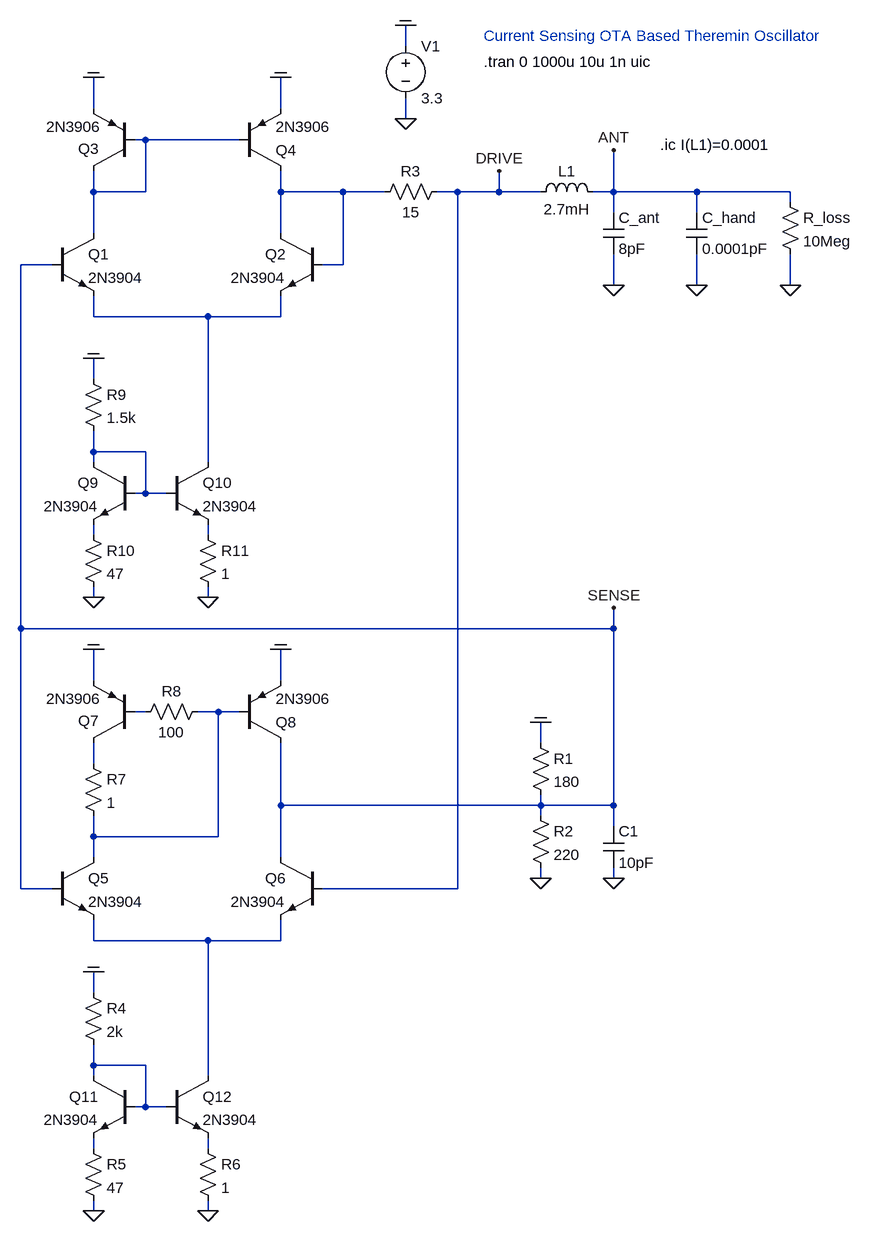
[diagram p0: schematic 2023_03_bjt_dual_ota_current_sensing_oscillator_v01.asc]
2023_03_bjt_dual_ota_current_sensing_oscillator_v01.asc, the LTspice schematic file:
Version 4
SHEET 1 16292 18036
WIRE 8192 11392 8192 11360
WIRE 7712 11488 7712 11440
WIRE 8000 11488 8000 11440
WIRE 8192 11504 8192 11472
WIRE 7792 11536 7776 11536
WIRE 7936 11536 7792 11536
WIRE 7712 11616 7712 11584
WIRE 7792 11616 7792 11536
WIRE 7792 11616 7712 11616
WIRE 8000 11616 8000 11584
WIRE 8096 11616 8000 11616
WIRE 8160 11616 8096 11616
WIRE 8272 11616 8240 11616
WIRE 8336 11616 8336 11584
WIRE 8336 11616 8272 11616
WIRE 8400 11616 8336 11616
WIRE 8512 11616 8512 11552
WIRE 8512 11616 8480 11616
WIRE 8640 11616 8512 11616
WIRE 8784 11616 8640 11616
WIRE 8784 11632 8784 11616
WIRE 8512 11648 8512 11616
WIRE 8640 11648 8640 11616
WIRE 7712 11680 7712 11616
WIRE 8000 11680 8000 11616
WIRE 7648 11728 7600 11728
WIRE 8096 11728 8096 11616
WIRE 8096 11728 8064 11728
WIRE 8512 11760 8512 11712
WIRE 8640 11760 8640 11712
WIRE 8784 11760 8784 11712
WIRE 7712 11808 7712 11776
WIRE 7888 11808 7712 11808
WIRE 8000 11808 8000 11776
WIRE 8000 11808 7888 11808
WIRE 7712 11904 7712 11872
WIRE 7712 12016 7712 11984
WIRE 7792 12016 7712 12016
WIRE 7712 12032 7712 12016
WIRE 7888 12032 7888 11808
WIRE 7792 12080 7792 12016
WIRE 7792 12080 7776 12080
WIRE 7824 12080 7792 12080
WIRE 7712 12144 7712 12128
WIRE 7888 12144 7888 12128
WIRE 7712 12240 7712 12224
WIRE 7888 12240 7888 12224
WIRE 7600 12288 7600 11728
WIRE 8512 12288 8512 12256
WIRE 8512 12288 7600 12288
WIRE 7712 12368 7712 12320
WIRE 8000 12368 8000 12320
WIRE 7792 12416 7776 12416
WIRE 7904 12416 7872 12416
WIRE 7936 12416 7904 12416
WIRE 8400 12464 8400 12432
WIRE 7712 12496 7712 12464
WIRE 8000 12560 8000 12464
WIRE 8400 12560 8400 12544
WIRE 8400 12560 8000 12560
WIRE 8512 12560 8512 12288
WIRE 8512 12560 8400 12560
WIRE 8400 12576 8400 12560
WIRE 8512 12592 8512 12560
WIRE 7712 12608 7712 12576
WIRE 7904 12608 7904 12416
WIRE 7904 12608 7712 12608
WIRE 7712 12640 7712 12608
WIRE 8000 12640 8000 12560
WIRE 8400 12672 8400 12656
WIRE 8512 12672 8512 12656
WIRE 7600 12688 7600 12288
WIRE 7648 12688 7600 12688
WIRE 8272 12688 8272 11616
WIRE 8272 12688 8064 12688
WIRE 7712 12768 7712 12736
WIRE 7888 12768 7712 12768
WIRE 8000 12768 8000 12736
WIRE 8000 12768 7888 12768
WIRE 7712 12848 7712 12816
WIRE 7712 12960 7712 12928
WIRE 7792 12960 7712 12960
WIRE 7712 12976 7712 12960
WIRE 7888 12976 7888 12768
WIRE 7792 13024 7792 12960
WIRE 7792 13024 7776 13024
WIRE 7824 13024 7792 13024
WIRE 7712 13088 7712 13072
WIRE 7888 13088 7888 13072
WIRE 7712 13184 7712 13168
WIRE 7888 13184 7888 13168
FLAG 8192 11504 0
FLAG 8192 11360 COM
FLAG 7712 13184 0
FLAG 7888 13184 0
FLAG 7712 12816 COM
FLAG 7712 12320 COM
FLAG 8000 12320 COM
FLAG 8400 12432 COM
FLAG 8400 12672 0
FLAG 7712 12240 0
FLAG 7888 12240 0
FLAG 7712 11872 COM
FLAG 7712 11440 COM
FLAG 8000 11440 COM
FLAG 8512 11760 0
FLAG 8512 11552 ANT
FLAG 8640 11760 0
FLAG 8784 11760 0
FLAG 8336 11584 DRIVE
FLAG 8512 12256 SENSE
FLAG 8512 12672 0
SYMBOL voltage 8192 11376 R0
WINDOW 123 0 0 Left 0
WINDOW 39 0 0 Left 0
SYMATTR InstName V1
SYMATTR Value 3.3
SYMBOL npn 7776 12976 M0
SYMATTR InstName Q11
SYMATTR Value 2N3904
SYMBOL res 7696 13072 R0
WINDOW 0 36 40 Left 2
WINDOW 3 36 76 Left 2
SYMATTR InstName R5
SYMATTR Value 47
SYMBOL npn 7824 12976 R0
SYMATTR InstName Q12
SYMATTR Value 2N3904
SYMBOL res 7872 13072 R0
WINDOW 0 36 40 Left 2
WINDOW 3 36 76 Left 2
SYMATTR InstName R6
SYMATTR Value 1
SYMBOL npn 7648 12640 R0
SYMATTR InstName Q5
SYMATTR Value 2N3904
SYMBOL npn 8064 12640 M0
SYMATTR InstName Q6
SYMATTR Value 2N3904
SYMBOL pnp 7936 12464 M180
SYMATTR InstName Q8
SYMATTR Value 2N3906
SYMBOL pnp 7776 12464 R180
WINDOW 0 55 34 Left 2
WINDOW 3 52 68 Left 2
SYMATTR InstName Q7
SYMATTR Value 2N3906
SYMBOL res 7888 12400 R90
WINDOW 0 0 56 VBottom 2
WINDOW 3 32 56 VTop 2
SYMATTR InstName R8
SYMATTR Value 100
SYMBOL res 7696 12480 R0
WINDOW 0 36 40 Left 2
WINDOW 3 36 76 Left 2
SYMATTR InstName R7
SYMATTR Value 1
SYMBOL res 8384 12560 R0
WINDOW 0 36 40 Left 2
WINDOW 3 36 76 Left 2
SYMATTR InstName R2
SYMATTR Value 220
SYMBOL res 8384 12448 R0
WINDOW 0 36 40 Left 2
WINDOW 3 36 76 Left 2
SYMATTR InstName R1
SYMATTR Value 180
SYMBOL npn 7776 12032 M0
SYMATTR InstName Q9
SYMATTR Value 2N3904
SYMBOL res 7696 12128 R0
WINDOW 0 36 40 Left 2
WINDOW 3 36 76 Left 2
SYMATTR InstName R10
SYMATTR Value 47
SYMBOL npn 7824 12032 R0
SYMATTR InstName Q10
SYMATTR Value 2N3904
SYMBOL res 7872 12128 R0
WINDOW 0 36 40 Left 2
WINDOW 3 36 76 Left 2
SYMATTR InstName R11
SYMATTR Value 1
SYMBOL npn 7648 11680 R0
SYMATTR InstName Q1
SYMATTR Value 2N3904
SYMBOL npn 8064 11680 M0
SYMATTR InstName Q2
SYMATTR Value 2N3904
SYMBOL pnp 7936 11584 M180
SYMATTR InstName Q4
SYMATTR Value 2N3906
SYMBOL pnp 7776 11584 R180
WINDOW 0 55 34 Left 2
WINDOW 3 52 68 Left 2
SYMATTR InstName Q3
SYMATTR Value 2N3906
SYMBOL cap 8496 11648 R0
SYMATTR InstName C_ant
SYMATTR Value 8pF
SYMBOL cap 8624 11648 R0
SYMATTR InstName C_hand
SYMATTR Value 0.0001pF
SYMBOL res 8768 11616 R0
WINDOW 0 36 40 Left 2
WINDOW 3 36 76 Left 2
SYMATTR InstName R_loss
SYMATTR Value 10Meg
SYMBOL ind 8384 11632 R270
WINDOW 0 32 56 VTop 2
WINDOW 3 5 56 VBottom 2
SYMATTR InstName L1
SYMATTR Value 2.7mH
SYMATTR SpiceLine Ipk=0.5 Rser=120 Cpar=1.1pF
SYMBOL res 8256 11600 R90
WINDOW 0 0 56 VBottom 2
WINDOW 3 32 56 VTop 2
SYMATTR InstName R3
SYMATTR Value 15
SYMBOL res 7696 12832 R0
WINDOW 0 36 40 Left 2
WINDOW 3 36 76 Left 2
SYMATTR InstName R4
SYMATTR Value 2k
SYMBOL res 7696 11888 R0
WINDOW 0 36 40 Left 2
WINDOW 3 36 76 Left 2
SYMATTR InstName R9
SYMATTR Value 1.5k
SYMBOL cap 8496 12592 R0
SYMATTR InstName C1
SYMATTR Value 10pF
TEXT 8312 11416 Left 2 !.tran 0 1000u 10u 1n uic
TEXT 8312 11376 Left 2 ;Current Sensing OTA Based Theremin Oscillator
TEXT 8584 11544 Left 2 !.ic I(L1)=0.0001

The netlist it stands for:
* 2023_03_bjt_dual_ota_current_sensing_oscillator_v01.asc
V1 COM 0 3.3
Q11 N011 N011 N012 0 2N3904
R5 N012 0 47
Q12 N010 N011 N013 0 2N3904
R6 N013 0 1
Q5 N008 SENSE N010 0 2N3904
Q6 SENSE DRIVE N010 0 2N3904
Q8 SENSE N008 COM 0 2N3906
Q7 N009 N007 COM 0 2N3906
R8 N008 N007 100
R7 N009 N008 1
R2 SENSE 0 220
R1 COM SENSE 180
Q9 N004 N004 N005 0 2N3904
R10 N005 0 47
Q10 N003 N004 N006 0 2N3904
R11 N006 0 1
Q1 N001 SENSE N003 0 2N3904
Q2 N002 N002 N003 0 2N3904
Q4 N002 N001 COM 0 2N3906
Q3 N001 N001 COM 0 2N3906
C_ant ANT 0 8pF
C_hand ANT 0 0.0001pF
R_loss ANT 0 10Meg
L1 DRIVE ANT 2.7mH Ipk=0.5 Rser=120 Cpar=1.1pF
R3 DRIVE N002 15
R4 COM N011 2k
R9 COM N004 1.5k
C1 SENSE 0 10pF
.model NPN NPN
.model PNP PNP
.lib standard.bjt
.tran 0 1000u 10u 1n uic
* Current Sensing OTA Based Theremin Oscillator
.ic I(L1)=0.0001
.backanno
.end